# Altium schematic sheet CONNECTORS.SchDoc
size A
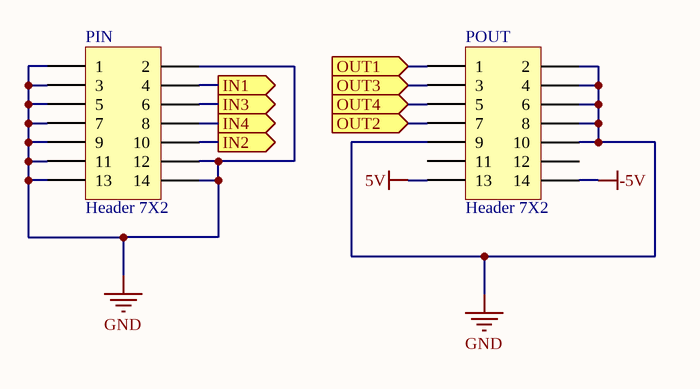
[diagram p0: CONNECTORS.SchDoc]

## Parts
PIN  Header 7X2  [CLP-107-02-L-DH-TR]
POUT  Header 7X2  [FTSH-107-01-L-DH]

## Ports
IN1 (out), IN2 (out), IN3 (out), IN4 (out), OUT1 (in), OUT2 (in), OUT3 (in), OUT4 (in)

## Nets
5V: POUT.13
-5V: POUT.14
GND: PIN.1 PIN.2 PIN.3 PIN.5 PIN.7 PIN.9 PIN.11 PIN.12 PIN.13 PIN.14 POUT.2 POUT.4 POUT.6 POUT.8 POUT.9 POUT.10
IN1: PIN.4 ; port IN1
IN2: PIN.10 ; port IN2
IN3: PIN.6 ; port IN3
IN4: PIN.8 ; port IN4
OUT1: POUT.1 ; port OUT1
OUT2: POUT.7 ; port OUT2
OUT3: POUT.3 ; port OUT3
OUT4: POUT.5 ; port OUT4

Not connected (* = marked no-connect by the designer): POUT 11 12

## Library data of the parts
PIN POUT = Header 7X2: Header, 7-Pin, Dual row; System: Connector; LatestRevisionDate: 17-Jul-2002; LatestRevisionNote: Re-released for DXP Platform.; Publisher: Altium Limited